# EAGLE design breakout_MDBT40 (EAGLE 8.1.1)
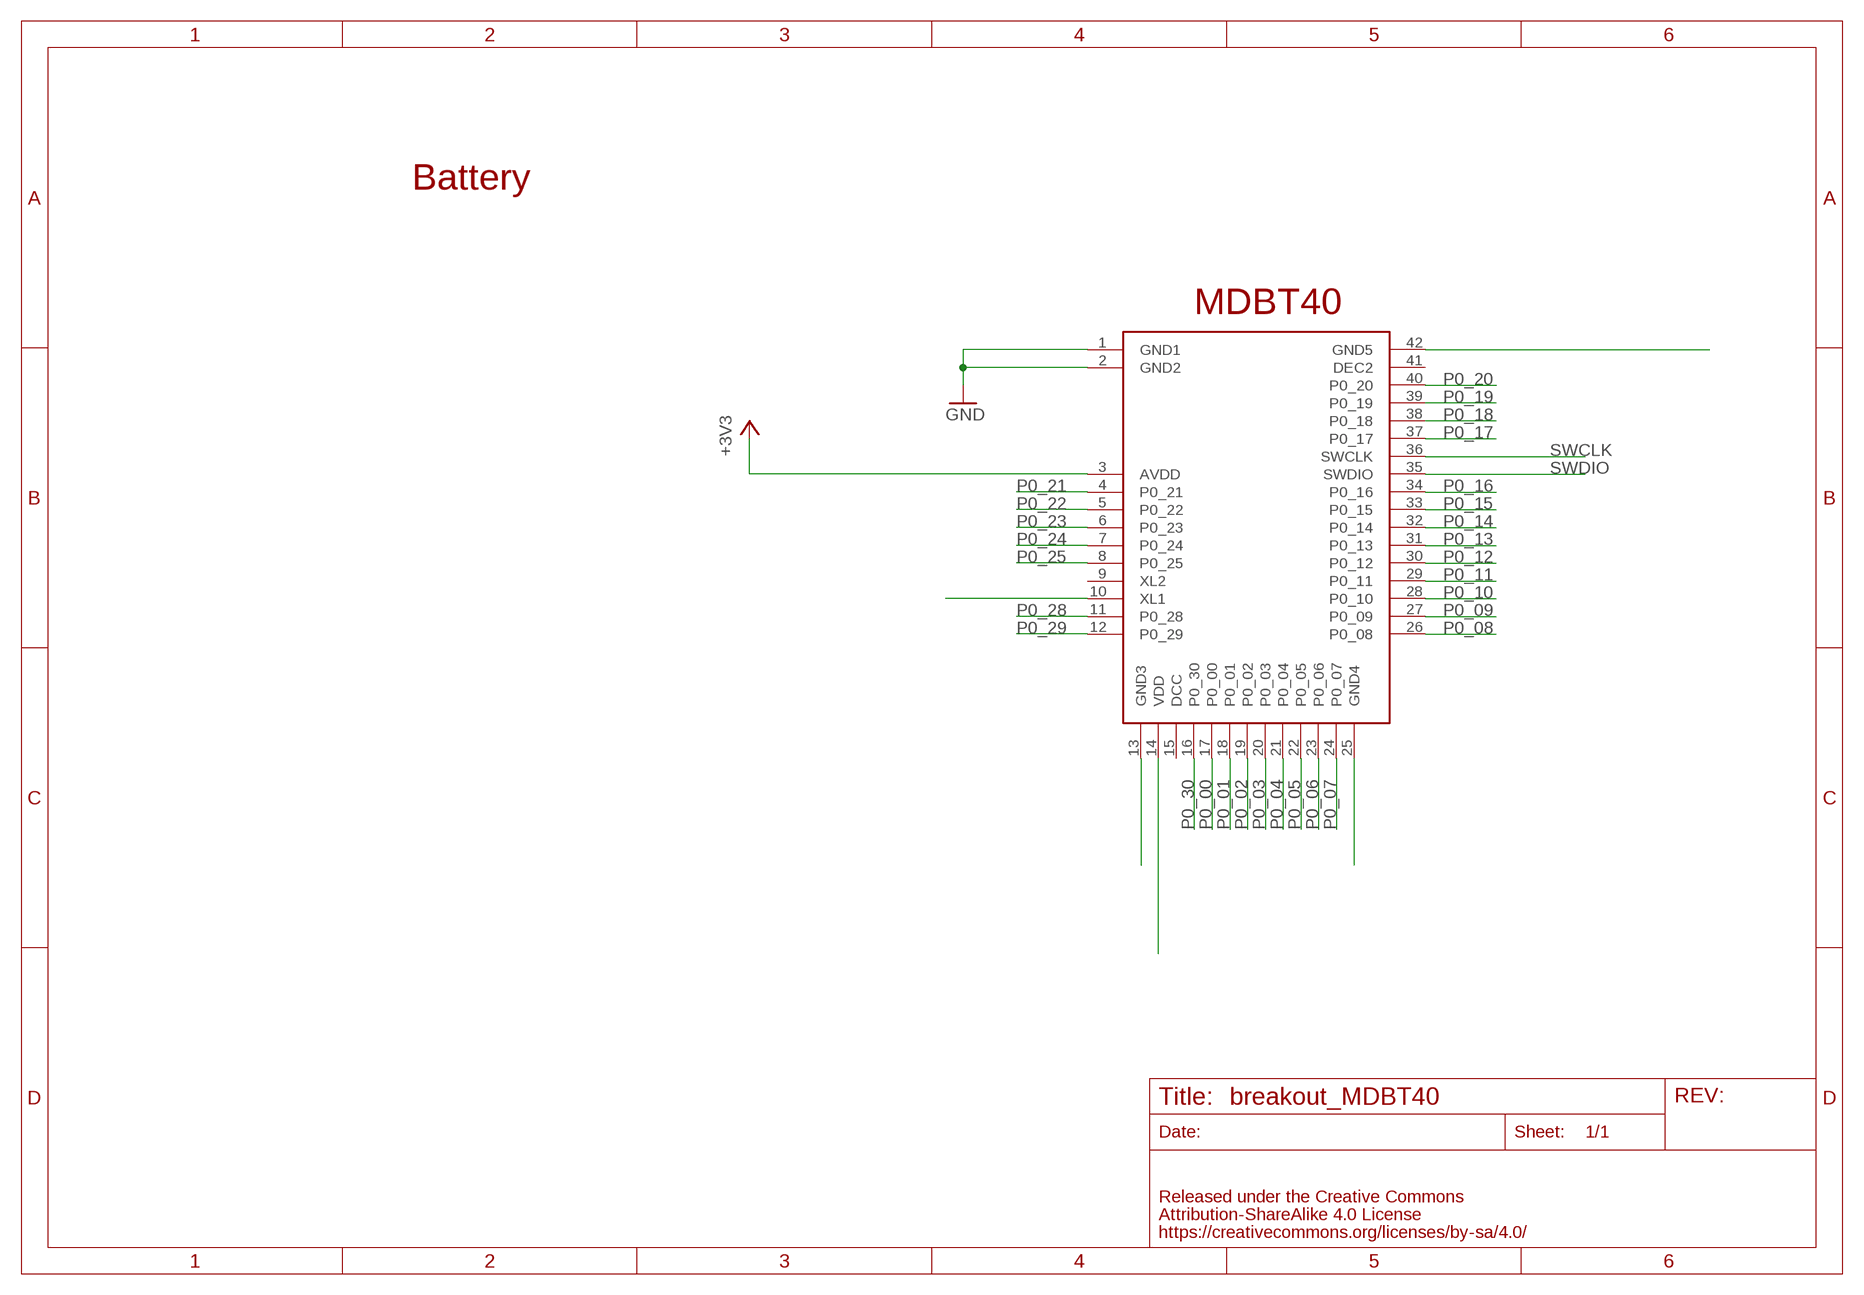
[diagram p0: schematic, sheet 1]

## Parts
U$1  RAYTAC-MDBT40  [RAYTAC-MDBT40]

## Nets
+3V3: U$1.3(AVDD)
GND: U$1.1(GND1) U$1.2(GND2)
N$1: U$1.14(VDD)
N$2: U$1.25(GND4)
N$3: U$1.13(GND3)
N$4: U$1.42(GND5)
N$8: U$1.10(XL1)
P0_00: U$1.17(P0_00)
P0_01: U$1.18(P0_01)
P0_02: U$1.19(P0_02)
P0_03: U$1.20(P0_03)
P0_04: U$1.21(P0_04)
P0_05: U$1.22(P0_05)
P0_06: U$1.23(P0_06)
P0_07: U$1.24(P0_07)
P0_08: U$1.26(P0_08)
P0_09: U$1.27(P0_09)
P0_10: U$1.28(P0_10)
P0_11: U$1.29(P0_11)
P0_12: U$1.30(P0_12)
P0_13: U$1.31(P0_13)
P0_14: U$1.32(P0_14)
P0_15: U$1.33(P0_15)
P0_16: U$1.34(P0_16)
P0_17: U$1.37(P0_17)
P0_18: U$1.38(P0_18)
P0_19: U$1.39(P0_19)
P0_20: U$1.40(P0_20)
P0_21: U$1.4(P0_21)
P0_22: U$1.5(P0_22)
P0_23: U$1.6(P0_23)
P0_24: U$1.7(P0_24)
P0_25: U$1.8(P0_25)
P0_28: U$1.11(P0_28)
P0_29: U$1.12(P0_29)
P0_30: U$1.16(P0_30)
SWCLK: U$1.36(SWCLK)
SWDIO: U$1.35(SWDIO)
Unconnected: U$1.9(XL2) U$1.15(DCC) U$1.41(DEC2)

## Notes on the sheet
- Battery
- MDBT40

## Library data of the parts
U$1 = gclueBT:RAYTAC-MDBT40

## Board
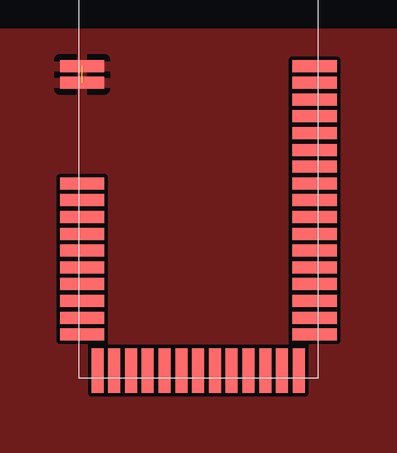
[diagram p1: board, top side]
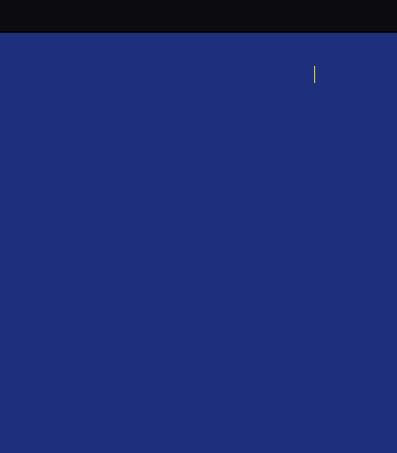
[diagram p2: board, bottom side, seen from below]

No outline drawn. Coordinates in mm, seen from the top.
Copper layers (1*16): Top 0.035mm / dielectric 1.5mm / Bottom 0.035mm
Design rules "SeeedStudio_2layer_DRU_no_angle_20140221": minimum track width 6mil, minimum drill 12mil, track to track 6mil, track to pad 6mil, pad to pad 6mil, via to via 6mil, smd to smd 0mil, copper to edge 10mil, drill to drill 10mil, minimum pad ring 10mil, minimum via ring 6mil, stop-mask expansion 2mil, vias tented up to drill 100mil, thermal gap 10mil
tRestrict: area -2.1,70.4 to 33.3,75.1
bRestrict: area -2.4,70.2 to 33.1,74.6

### Footprints (pad centres in the part's own frame; a part is rotated, then mirrored left to right if it is on the bottom)
RAYTAC-MDBT40 = smd 1.85 x 0.5: 1 -4.86,4; 2 -4.86,3.3; 3 -4.86,-0.9; 4 -4.86,-1.6; 5 -4.86,-2.3; 6 -4.86,-3; 7 -4.86,-3.7; 8 -4.86,-4.4; 9 -4.86,-5.1; 10 -4.86,-5.8; 11 -4.86,-6.5; 12 -4.86,-7.2; 26 4.84,-7.2; 27 4.84,-6.5; 28 4.84,-5.8; 29 4.84,-5.1; 30 4.84,-4.4; 31 4.84,-3.7; 32 4.84,-3; 33 4.84,-2.3; 34 4.84,-1.6; 35 4.84,-0.9; 36 4.84,-0.2; 37 4.84,0.5; 38 4.84,1.2; 39 4.84,1.9; 40 4.84,2.6; 41 4.84,3.3; 42 4.84,4 | smd 0.5 x 1.85: 13 -4.22,-8.71; 14 -3.52,-8.71; 15 -2.82,-8.71; 16 -2.12,-8.71; 17 -1.42,-8.71; 18 -0.72,-8.71; 19 -0.02,-8.71; 20 0.68,-8.71; 21 1.38,-8.71; 22 2.08,-8.71; 23 2.78,-8.71; 24 3.48,-8.71; 25 4.18,-8.71

### Placement (x,y rotation side)
U$1  16.55,64.78 0 top
U$7  [LOGO_FABO_S]  23.61,30.93 0 top

### Tracks (layer width: path | path; a pad name or v marks a point on that pad's centre or on a via)
GND  (1 unrouted)
  pour Top: 0,0 32,0 32,72 0,72
  pour Bottom: 0,0 32,0 32,72 0,72

### Text on the board
tPlace: Rev.20151115